# EasyEDA schematic JLPCB_DATA_LOGGER_schematic.json
TITLE: Sheet_1; REV: 1.0; Date: 2023-07-03; Sheet: 1/1; Company: Your Company
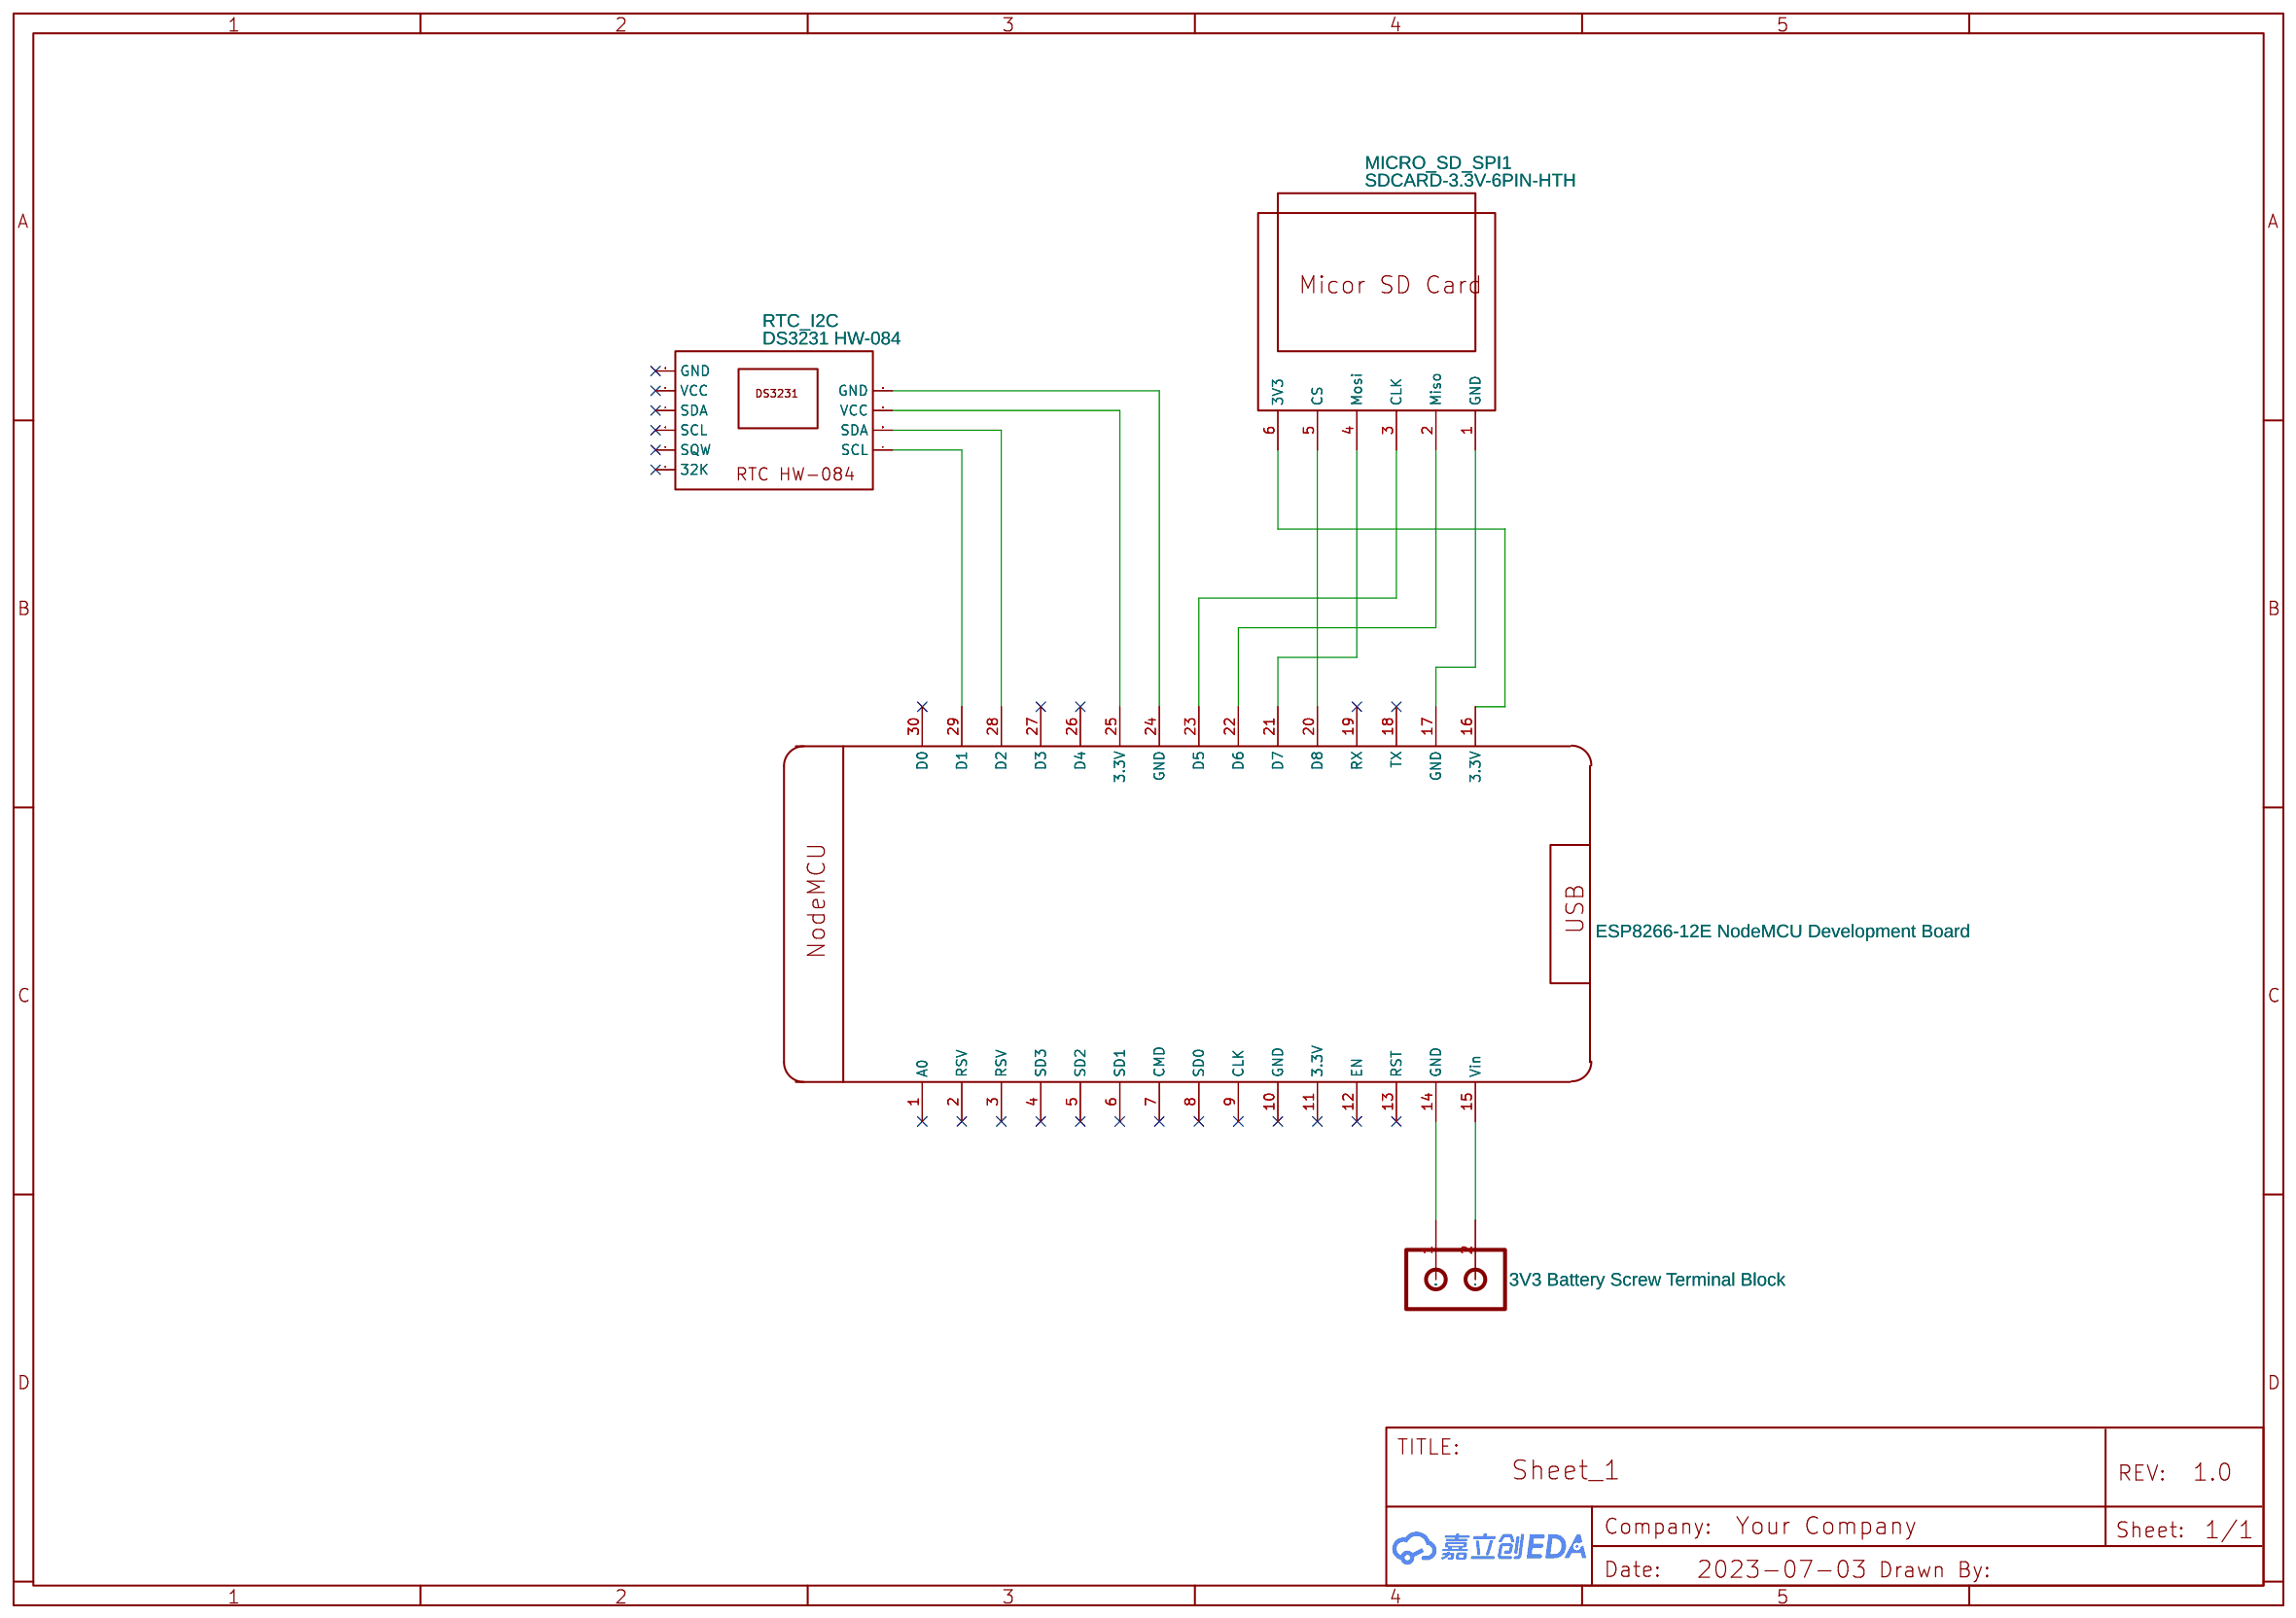
[diagram p0: schematic sheet]

## Parts
MICRO_SD_SPI1  SDCARD-3.3V-6PIN-HTH  [SDCARD-3.,3V-6PIN-HTH]
NO1  3V3 Battery Screw Terminal Block  [SCREW_TERMINAL_BLOCK_2_PIN]
RTC_I2C  DS3231 HW-084  [DS3231 HW-084]
U1  ESP8266-12E NodeMCU Development Board  [NODEMCU ESP8266]

## Library data of the parts
MICRO_SD_SPI1 = SDCARD-3.3V-6PIN-HTH: Manufacturer: Aliexpress; Manufacturer Part: Aliexpress; Contributor: Terhart
NO1 = Screw_Terminal_Block_2_Pin: Supplier Part: HM3173; link: https://www.jaycar.com.au/3-way-pcb-mount-screw-terminal-5mm-pitch/p/HM3173; Contributor: Fal Ko
RTC_I2C = DS3231 HW-084: Contributor: Vik_g
U1 = NODEMCU COPY: Contributor: nrn.nitb

## Nets
Net-(MICRO_SD_SPI1-1): MICRO_SD_SPI1.1(GND) U1.17(GND)
Net-(MICRO_SD_SPI1-2): MICRO_SD_SPI1.2(Miso) U1.22(D6)
Net-(MICRO_SD_SPI1-3): MICRO_SD_SPI1.3(CLK) U1.23(D5)
Net-(MICRO_SD_SPI1-4): MICRO_SD_SPI1.4(Mosi) U1.21(D7)
Net-(MICRO_SD_SPI1-5): MICRO_SD_SPI1.5(CS) U1.20(D8)
Net-(MICRO_SD_SPI1-6): MICRO_SD_SPI1.6(3V3) U1.16(3.3V)
Net-(NO1-1): NO1.1(GND) U1.14(GND)
Net-(NO1-2): NO1.2(3V3) U1.15(Vin)
Net-(RTC_I2C-7): RTC_I2C.7(SCL) U1.29(D1)
Net-(RTC_I2C-8): RTC_I2C.8(SDA) U1.28(D2)
Net-(RTC_I2C-9): RTC_I2C.9(VCC) U1.25(3.3V)
Net-(RTC_I2C-10): RTC_I2C.10(GND) U1.24(GND)

Not connected (* = marked no-connect by the designer): RTC_I2C 1(32K)* 2(SQW)* 3(SCL)* 4(SDA)* 5(VCC)* 6(GND)*; U1 1(A0)* 2(RSV)* 3(RSV)* 4(SD3)* 5(SD2)* 6(SD1)* 7(CMD)* 8(SD0)* 9(CLK)* 10(GND)* 11(3.3V)* 12(EN)* 13(RST)* 18(TX)* 19(RX)* 26(D4)* 27(D3)* 30(D0)*
